# Altium schematic sheet H18R1_Frontend 1.SchDoc
size Letter; CompanyName: Hexabitz; DocumentNumber: 2; SheetNumber: 2; SheetTotal: 3
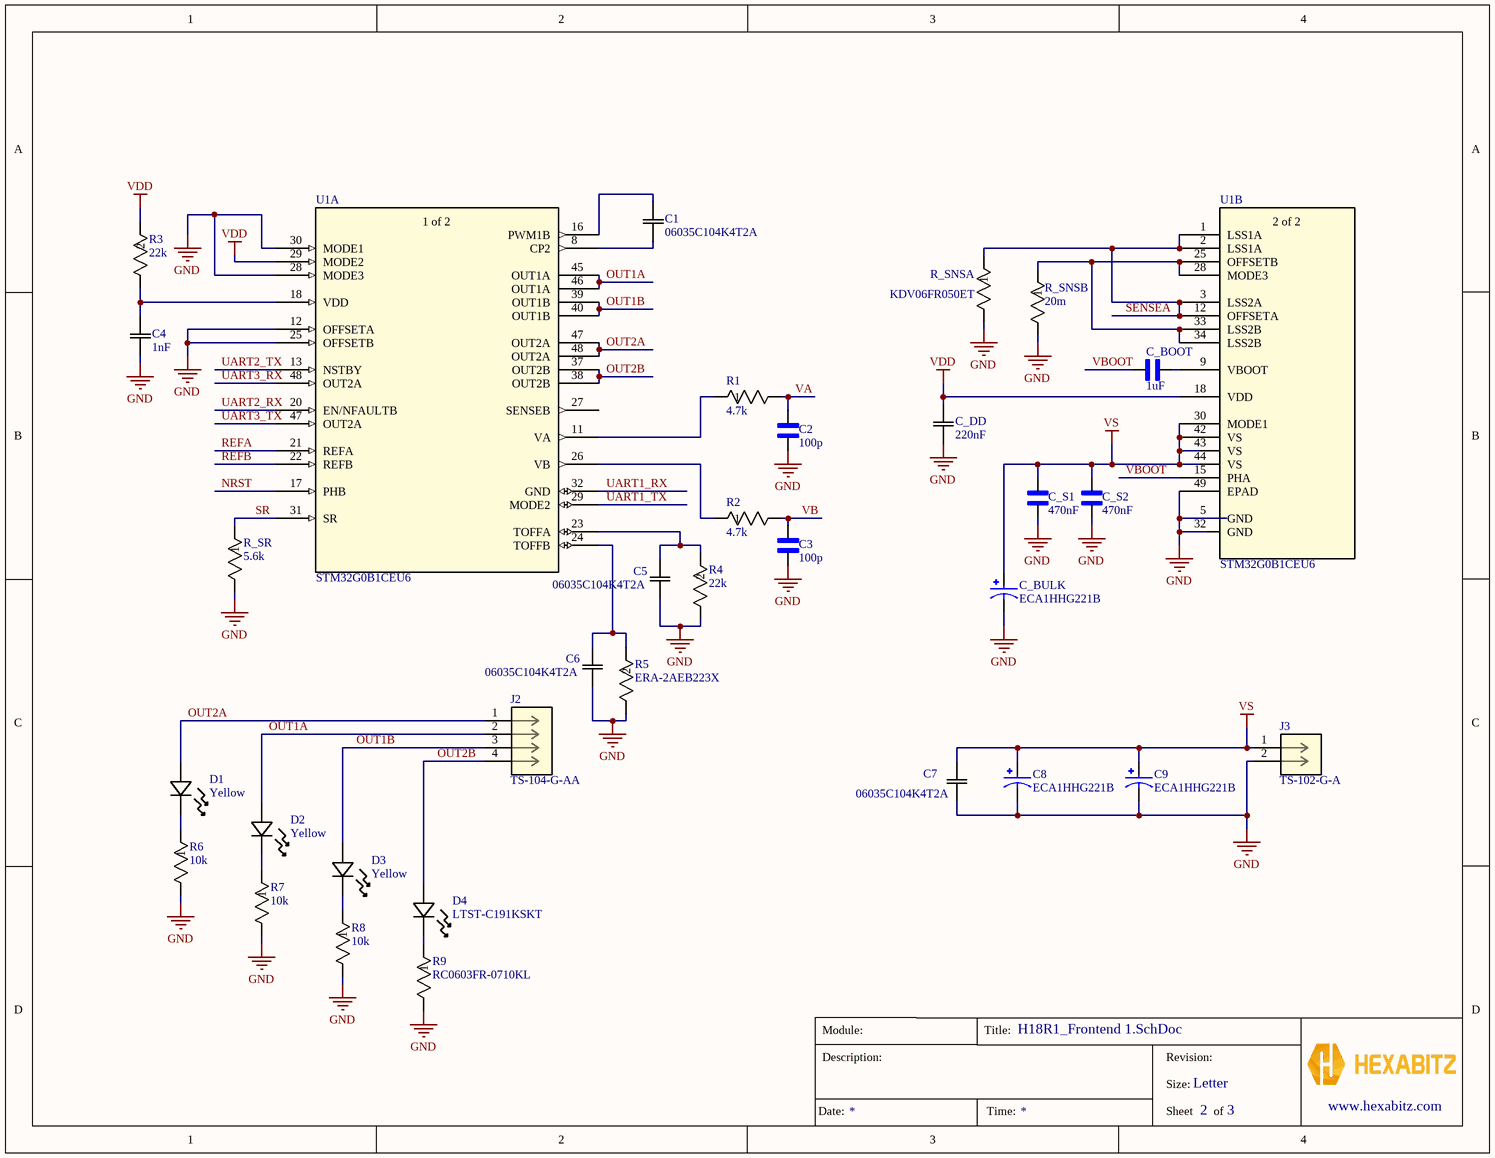
[diagram p0: H18R1_Frontend 1.SchDoc]

## Parts
C1  06035C104K4T2A  [CAP_0603_AVX]
C2  100p  [CAPC1005X55N]
C3  100p  [CAPC1005X55N]
C4  1nF  [CAPC17595_87N_KEM]
C5  06035C104K4T2A  [CAP_0603_AVX]
C6  06035C104K4T2A  [CAP_0603_AVX]
C7  06035C104K4T2A  [CAP_0603_AVX]
C8  ECA1HHG221B  [CAPPRD500W60D1000H1250]
C9  ECA1HHG221B  [CAPPRD500W60D1000H1250]
C_BOOT  1uF  [CAPC2012X135N]
C_BULK  ECA1HHG221B  [CAPPRD500W60D1000H1250]
C_DD  220nF  [cap_UMK105 CG080CV-F_TAY]
C_S1  470nF  [CAPC1005X60N]
C_S2  470nF  [CAPC1005X60N]
D1  Yellow  [LED_LTST-C191KRKT_LTO]
D2  Yellow  [LED_LTST-C191KRKT_LTO]
D3  Yellow  [LED_LTST-C191KRKT_LTO]
D4  LTST-C191KSKT  [LED_LTST-C191KRKT_LTO]
J2  TS-104-G-AA  [CON4_1X4_TU_HTS_SAI]
J3  TS-102-G-A  [CON2_1X2_TU_HTS_SAI]
R1  4.7k  [YAG_R0402_YAG]
R2  4.7k  [YAG_R0402_YAG]
R3  22k  [RC0402N_PAN]
R4  22k  [RC0402N_PAN]
R5  ERA-2AEB223X  [RC0402N_PAN]
R6  10k  [RC0603N_YAG]
R7  10k  [RC0603N_YAG]
R8  10k  [RC0603N_YAG]
R9  RC0603FR-0710KL  [RC0603N_YAG]
R_SNSA  KDV06FR050ET  [RES_KDV06_OHM]
R_SNSB  20m  [RES_KDV06_OHM]
R_SR  5.6k  [YAG_R0402_YAG]
U1  STM32G0B1CEU6  [QFN50P700X700X65-49N-D]  (parts A,B of 2)

## Nets
GND: C2.2 C3.2 C4.2 C5.2 C6.2 C7.2 C8.N C9.N C_BULK.N C_DD.2 C_S1.2 C_S2.2 J3.2 R4.1 R5.1 R6.2 R7.2 R8.2 R9.2 R_SNSA.2 R_SNSB.2 R_SR.2 U1.5(GND) U1.12(OFFSETA) U1.25(OFFSETB) U1.28(MODE3) U1.30(MODE1) U1.32(GND) U1.49(EPAD)
VDD: C_DD.1 R3.2 U1.18(VDD) U1.29(MODE2)
VS: C7.1 C8.P C9.P C_BULK.P C_S1.1 C_S2.1 J3.1 U1.30(MODE1) U1.42(VS) U1.43(VS) U1.44(VS)
NRST: U1.17(PHB)
OUT1A: D2.2 J2.2 U1.45(OUT1A) U1.46(OUT1A)
OUT1B: D3.2 J2.3 U1.39(OUT1B) U1.40(OUT1B)
OUT2A: D1.2 J2.1 U1.47(OUT2A) U1.48(OUT2A)
OUT2B: D4.2 J2.4 U1.37(OUT2B) U1.38(OUT2B)
REFA: U1.21(REFA)
REFB: U1.22(REFB)
SENSEA: R_SNSA.1 U1.1(LSS1A) U1.2(LSS1A) U1.3(LSS2A) U1.12(OFFSETA)
SR: R_SR.1 U1.31(SR)
UART1_RX: U1.32(GND)
UART1_TX: U1.29(MODE2)
UART2_RX: U1.20(EN/NFAULTB)
UART2_TX: U1.13(NSTBY)
UART3_RX: U1.48(OUT2A)
UART3_TX: U1.47(OUT2A)
VA: C2.1 R1.2
VB: C3.1 R2.2
VBOOT: C_BOOT.1 U1.15(PHA)
NetC1_1: C1.1 U1.16(PWM1B)
NetC1_2: C1.2 U1.8(CP2)
NetC4_1: C4.1 R3.1 U1.18(VDD)
NetC5_1: C5.1 R4.2 U1.23(TOFFA)
NetC6_1: C6.1 R5.2 U1.24(TOFFB)
NetC_BOOT_2: C_BOOT.2 U1.9(VBOOT)
NetD1_1: D1.1 R6.1
NetD2_1: D2.1 R7.1
NetD3_1: D3.1 R8.1
NetD4_1: D4.1 R9.1
NetR1_1: R1.1 U1.11(VA)
NetR2_1: R2.1 U1.26(VB)
NetR_SNSB_1: R_SNSB.1 U1.25(OFFSETB) U1.28(MODE3) U1.33(LSS2B) U1.34(LSS2B)

Not connected (* = marked no-connect by the designer): U1 27(SENSEB)

## Notes on the sheet
- Module:
- Title:
- Description:
- Size:
- Revision:
- Letter
- www.hexabitz.com
- Date:
- Time:
- Sheet
- of
- (in symbol STSPIN948, part A) 1 of 2
- (in symbol STSPIN948, part B) 2 of 2

## Library data of the parts
C1 C5-C7 = 06035C104K4T2A: Description; Manufacturer_Name: KYOCERA AVX; Copyright: Copyright (C) 2025 Ultra Librarian. All rights reserved.; Manufacturer_Part_Number: 06035C104K4T2A
C2 C3 = CC0402JRNPO9BN101: 100 pF Â±5% 50V Ceramic Capacitor C0G, NP0 0402 (1005 Metric); MF: Yageo; SnapEDA_Link: https://www.snapeda.com/parts/CC0402JRNPO9BN101/Yageo/view-part/?ref=snap; Package: 0402 Yageo; Value: *; MP: CC0402JRNPO9BN101; Check_prices: https://www.snapeda.com/parts/CC0402JRNPO9BN101/Yageo/view-part/?ref=eda
C4 = C0603C102K5RACTU: SMD Comm X7R, Ceramic, 1000 pF, 10%, 50 VDC, X7R, SMD, MLCC, Temperature Stable, Class II, 0603; Manufacturer_Name: Kemet; Copyright: Copyright (C) 2025 Ultra Librarian. All rights reserved.; Manufacturer_Part_Number: C0603C102K5RACTU
C8 C9 C_BULK = ECA1HHG221B: Cap Aluminum Lytic 220uF 50V 20% (10 X 12.5mm) Radial 5mm 300mA 2000h 105??? Ammo Pack; MF: Panasonic Electronic; MP: ECA-1HHG221B; Package: RADIAL-2 Panasonic; Price: None; Availability: In Stock; Check_prices: https://www.snapeda.com/parts/ECA-1HHG221B/Panasonic%20Electronic%20Components/view-part/2303921/?ref=eda; SnapEDA_Link: https://www.snapeda.com/parts/ECA-1HHG221B/Panasonic%20Electronic%20Components/view-part/2303921/?ref=snap; Value: *
C_BOOT = CL21B105KBFNNNE: 1 ÂµF Â±10% 50V Ceramic Capacitor X7R 0805 (2012 Metric); MF: Samsung; SnapEDA_Link: https://www.snapeda.com/parts/CL21B105KBFNNNE/Samsung/view-part/?ref=snap; Package: SMD-2 Samsung; Value: *; MP: CL21B105KBFNNNE; Check_prices: https://www.snapeda.com/parts/CL21B105KBFNNNE/Samsung/view-part/?ref=eda
C_DD = UMK105BJ224KV-F: Description; Manufacturer_Name: TAIYO YUDEN; Copyright: Copyright (C) 2025 Ultra Librarian. All rights reserved.; Manufacturer_Part_Number: UMK105BJ224KV-F
C_S1 C_S2 = GRM155R61H474KE11D: SMD capacitor X5R(EIA) with capacitance 0.47uF Tol.10%. Rated voltage 50Vdc 85C; MF: Murata Electronics; SnapEDA_Link: https://www.snapeda.com/parts/GRM155R61H474KE11D/Murata+Electronics+North+America/view-part/?ref=snap; Package: 2012 Murata; Value: *; MP: GRM155R61H474KE11D; Check_prices: https://www.snapeda.com/parts/GRM155R61H474KE11D/Murata+Electronics+North+America/view-part/?ref=eda
D1-D4 = LTST-C191KSKT: Description; Manufacturer_Name: LITE-ON; Copyright: Copyright (C) 2025 Ultra Librarian. All rights reserved.; Manufacturer_Part_Number: LTST-C191KSKT
J2 = TS-104-G-AA: Description; Manufacturer_Name: Samtec Inc; Copyright: Copyright (C) 2025 Ultra Librarian. All rights reserved.; Manufacturer_Part_Number: TS-104-G-AA; RefDes: RefDes; Type: Type
J3 = TS-102-G-A: Description; Manufacturer_Name: Samtec Inc; Copyright: Copyright (C) 2025 Ultra Librarian. All rights reserved.; Manufacturer_Part_Number: TS-102-G-A; RefDes: RefDes; Type: Type
R1 R2 = RC0402FR-074K7L: Description; Manufacturer_Name: Yageo; Copyright: Copyright (C) 2025 Ultra Librarian. All rights reserved.; Manufacturer_Part_Number: RC0402FR-074K7L
R3-R5 = ERA-2AEB223X: Description; Manufacturer_Name: Panasonic; Copyright: Copyright (C) 2025 Ultra Librarian. All rights reserved.; Manufacturer_Part_Number: ERA-2AEB223X
R6-R9 = RC0603FR-0710KL: RES SMD 10kO 1% 1/10W 0603; Manufacturer_Name: Yageo; Copyright: Copyright (C) 2025 Ultra Librarian. All rights reserved.; Manufacturer_Part_Number: RC0603FR-0710KL
R_SNSA R_SNSB = KDV06FR050ET: Description; Manufacturer_Name: Ohmite; Copyright: Copyright (C) 2025 Ultra Librarian. All rights reserved.; Manufacturer_Part_Number: KDV06FR050ET
R_SR = RC0402FR-075K6L: No Description Available; Manufacturer_Name: Yageo; Copyright: Copyright (C) 2025 Ultra Librarian. All rights reserved.; Manufacturer_Part_Number: RC0402FR-075K6L
U1 = STSPIN948: Scalable 4.5 A dual full-bridge driver for brushed DC motors; Manufacturer_Name: STMicroelectronics; Type: Power Management; Copyright: Copyright (C) 2025 Ultra Librarian. All rights reserved.; Manufacturer_Part_Number: STSPIN948; Datasheet: https://www.st.com/resource/en/datasheet/stspin948.pdf; RefDes: RefDes